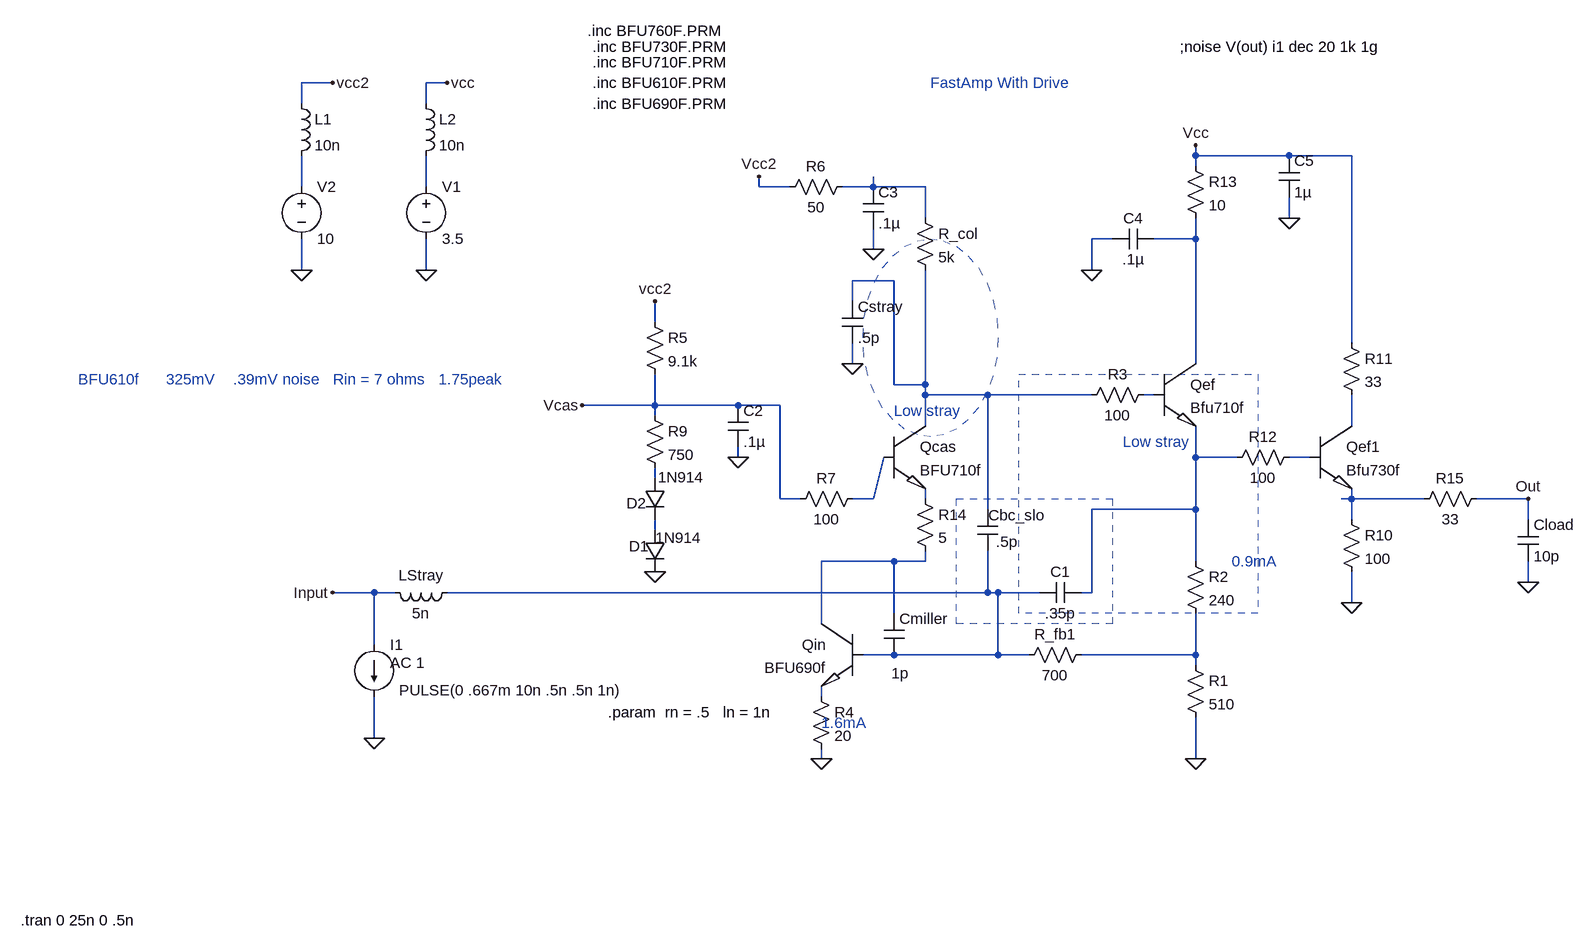
[diagram p0: schematic FastCE_Amp.asc]
FastCE_Amp.asc, the LTspice schematic file:
Version 4
SHEET 1 880 680
WIRE -1328 -1232 -1376 -1232
WIRE -1152 -1232 -1184 -1232
WIRE -1376 -1200 -1376 -1232
WIRE -1184 -1200 -1184 -1232
WIRE 0 -1120 0 -1136
WIRE 144 -1120 0 -1120
WIRE 240 -1120 144 -1120
WIRE 0 -1104 0 -1120
WIRE -1376 -1072 -1376 -1120
WIRE -1184 -1072 -1184 -1120
WIRE -672 -1072 -672 -1088
WIRE -624 -1072 -672 -1072
WIRE -496 -1072 -496 -1088
WIRE -496 -1072 -544 -1072
WIRE -416 -1072 -496 -1072
WIRE -416 -1024 -416 -1072
WIRE 144 -1024 144 -1056
WIRE -128 -992 -160 -992
WIRE 0 -992 0 -1024
WIRE 0 -992 -64 -992
WIRE -496 -976 -496 -1008
WIRE -1376 -944 -1376 -992
WIRE -1184 -944 -1184 -992
WIRE -160 -944 -160 -992
WIRE -464 -928 -528 -928
WIRE -528 -896 -528 -928
WIRE -832 -864 -832 -896
WIRE 240 -832 240 -1120
WIRE -528 -800 -528 -832
WIRE 0 -800 0 -992
WIRE -464 -768 -464 -928
WIRE -416 -768 -416 -944
WIRE -416 -768 -464 -768
WIRE -416 -752 -416 -768
WIRE -320 -752 -416 -752
WIRE -160 -752 -320 -752
WIRE -64 -752 -80 -752
WIRE -832 -736 -832 -784
WIRE -832 -736 -944 -736
WIRE -704 -736 -832 -736
WIRE -640 -736 -704 -736
WIRE -832 -720 -832 -736
WIRE -416 -704 -416 -752
WIRE 240 -704 240 -752
WIRE -704 -656 -704 -672
WIRE 0 -656 0 -704
WIRE 64 -656 0 -656
WIRE 176 -656 144 -656
WIRE -832 -624 -832 -640
WIRE -640 -592 -640 -736
WIRE -608 -592 -640 -592
WIRE -496 -592 -480 -656
WIRE -496 -592 -528 -592
WIRE -416 -592 -416 -608
WIRE 240 -592 240 -608
WIRE 240 -592 224 -592
WIRE 352 -592 240 -592
WIRE 512 -592 432 -592
WIRE -320 -576 -320 -752
WIRE 0 -576 0 -656
WIRE 0 -576 -160 -576
WIRE 240 -560 240 -592
WIRE 512 -560 512 -592
WIRE -832 -544 -832 -560
WIRE -464 -496 -576 -496
WIRE -416 -496 -416 -512
WIRE -416 -496 -464 -496
WIRE 0 -496 0 -576
WIRE 512 -464 512 -496
WIRE -1264 -448 -1328 -448
WIRE -1232 -448 -1264 -448
WIRE -320 -448 -320 -512
WIRE -320 -448 -1152 -448
WIRE -304 -448 -320 -448
WIRE -240 -448 -304 -448
WIRE -160 -448 -160 -576
WIRE -160 -448 -176 -448
WIRE 240 -432 240 -480
WIRE -464 -416 -464 -496
WIRE -576 -400 -576 -496
WIRE -1264 -368 -1264 -448
WIRE -464 -352 -512 -352
WIRE -304 -352 -304 -448
WIRE -304 -352 -464 -352
WIRE -256 -352 -304 -352
WIRE 0 -352 0 -416
WIRE 0 -352 -176 -352
WIRE 0 -336 0 -352
WIRE -576 -288 -576 -304
WIRE -1264 -224 -1264 -288
WIRE -576 -192 -576 -208
WIRE 0 -192 0 -256
FLAG 0 -1136 Vcc
FLAG -576 -192 0
FLAG 0 -192 0
FLAG -1328 -448 Input
FLAG -1184 -944 0
FLAG -1152 -1232 vcc
FLAG -1376 -944 0
FLAG -1328 -1232 vcc2
FLAG -672 -1088 Vcc2
FLAG -704 -656 0
FLAG -944 -736 Vcas
FLAG -832 -480 0
FLAG -832 -896 vcc2
FLAG -496 -976 0
FLAG -1264 -224 0
FLAG -528 -800 0
FLAG 240 -432 0
FLAG 512 -464 0
FLAG -160 -944 0
FLAG 144 -1024 0
FLAG 512 -592 Out
SYMBOL xnpn -512 -400 M0
SYMATTR InstName Qin
SYMATTR Value BFU690f
SYMBOL res -432 -1040 R0
SYMATTR InstName R_col
SYMATTR Value 5k
SYMBOL res -16 -352 R0
SYMATTR InstName R1
SYMATTR Value 510
SYMBOL xnpn -64 -800 R0
SYMATTR InstName Qef
SYMATTR Value Bfu710f
SYMBOL res -16 -512 R0
SYMATTR InstName R2
SYMATTR Value 240
SYMBOL res -160 -368 R90
WINDOW 0 0 56 VBottom 2
WINDOW 3 32 56 VTop 2
SYMATTR InstName R_fb1
SYMATTR Value 700
SYMBOL res -64 -768 R90
WINDOW 0 0 56 VBottom 2
WINDOW 3 32 56 VTop 2
SYMATTR InstName R3
SYMATTR Value 100
SYMBOL res -592 -304 R0
SYMATTR InstName R4
SYMATTR Value 20
SYMBOL cap -176 -464 R90
WINDOW 0 0 32 VBottom 2
WINDOW 3 32 32 VTop 2
SYMATTR InstName C1
SYMATTR Value .35p
SYMBOL current -1264 -368 R0
WINDOW 123 24 28 Left 2
WINDOW 39 0 0 Left 2
WINDOW 3 38 70 Left 2
SYMATTR Value2 AC 1
SYMATTR Value PULSE(0 .667m 10n .5n .5n 1n)
SYMATTR InstName I1
SYMBOL voltage -1184 -1088 R0
SYMATTR InstName V1
SYMATTR Value 3.5
SYMBOL voltage -1376 -1088 R0
WINDOW 123 0 0 Left 2
WINDOW 39 0 0 Left 2
SYMATTR InstName V2
SYMATTR Value 10
SYMBOL cap -336 -576 R0
WINDOW 0 17 9 Left 2
WINDOW 3 29 50 Left 2
SYMATTR InstName Cbc_slo
SYMATTR Value .5p
SYMBOL xnpn -480 -704 R0
SYMATTR InstName Qcas
SYMATTR Value BFU710f
SYMBOL res -512 -608 R90
WINDOW 0 0 56 VBottom 2
WINDOW 3 32 56 VTop 2
SYMATTR InstName R7
SYMATTR Value 100
SYMBOL cap -720 -736 R0
SYMATTR InstName C2
SYMATTR Value .1µ
SYMBOL diode -848 -544 R0
WINDOW 0 -24 25 Left 2
WINDOW 3 17 12 Left 2
SYMATTR InstName D1
SYMATTR Value 1N914
SYMBOL diode -848 -624 R0
WINDOW 0 -28 39 Left 2
WINDOW 3 21 -1 Left 2
SYMATTR InstName D2
SYMATTR Value 1N914
SYMBOL res -848 -880 R0
SYMATTR InstName R5
SYMATTR Value 9.1k
SYMBOL cap -512 -1072 R0
SYMATTR InstName C3
SYMATTR Value .1µ
SYMBOL res -528 -1088 R90
WINDOW 0 0 56 VBottom 2
WINDOW 3 32 56 VTop 2
SYMATTR InstName R6
SYMATTR Value 50
SYMBOL ind -1136 -464 R90
WINDOW 0 5 56 VBottom 2
WINDOW 3 32 56 VTop 2
SYMATTR InstName LStray
SYMATTR Value 5n
SYMBOL res -848 -736 R0
SYMATTR InstName R9
SYMATTR Value 750
SYMBOL cap -544 -896 R0
SYMATTR InstName Cstray
SYMATTR Value .5p
SYMBOL xnpn 176 -704 R0
SYMATTR InstName Qef1
SYMATTR Value Bfu730f
SYMBOL res 224 -576 R0
SYMATTR InstName R10
SYMATTR Value 100
SYMBOL res 224 -848 R0
SYMATTR InstName R11
SYMATTR Value 33
SYMBOL cap 496 -560 R0
SYMATTR InstName Cload
SYMATTR Value 10p
SYMBOL res 160 -672 R90
WINDOW 0 0 56 VBottom 2
WINDOW 3 32 56 VTop 2
SYMATTR InstName R12
SYMATTR Value 100
SYMBOL ind -1392 -1216 R0
SYMATTR InstName L1
SYMATTR Value 10n
SYMBOL ind -1200 -1216 R0
SYMATTR InstName L2
SYMATTR Value 10n
SYMBOL res -16 -1120 R0
SYMATTR InstName R13
SYMATTR Value 10
SYMBOL cap -64 -1008 R90
WINDOW 0 0 32 VBottom 2
WINDOW 3 32 32 VTop 2
SYMATTR InstName C4
SYMATTR Value .1µ
SYMBOL cap -480 -416 R0
WINDOW 3 12 92 Left 2
SYMATTR InstName Cmiller
SYMATTR Value 1p
SYMBOL cap 128 -1120 R0
SYMATTR InstName C5
SYMATTR Value 1µ
SYMBOL res -432 -608 R0
SYMATTR InstName R14
SYMATTR Value 5
SYMBOL res 448 -608 R90
WINDOW 0 0 56 VBottom 2
WINDOW 3 32 56 VTop 2
SYMATTR InstName R15
SYMATTR Value 33
TEXT -928 -1288 Left 2 !.inc BFU730F.PRM
TEXT -928 -1264 Left 2 !.inc BFU710F.PRM
TEXT -904 -264 Left 2 !.param  rn = .5   ln = 1n
TEXT -1808 56 Left 2 !.tran 0 25n 0 .5n
TEXT -928 -1232 Left 2 !.inc BFU610F.PRM
TEXT -928 -1200 Left 2 !.inc BFU690F.PRM
TEXT -24 -1288 Left 2 !;noise V(out) i1 dec 20 1k 1g
TEXT -1720 -776 Left 2 ;BFU610f      325mV    .39mV noise   Rin = 7 ohms   1.75peak
TEXT -576 -248 Left 2 ;1.6mA
TEXT 56 -496 Left 2 ;0.9mA
TEXT -464 -728 Left 2 ;Low stray
TEXT -112 -680 Left 2 ;Low stray
TEXT -408 -1232 Left 2 ;FastAmp With Drive
TEXT -936 -1312 Left 2 !.inc BFU760F.PRM
RECTANGLE Normal -128 -400 -368 -592 2
RECTANGLE Normal 96 -416 -272 -784 2
CIRCLE Normal -512 -688 -304 -992 2

The netlist it stands for:
* FastCE_Amp.asc
XQin N015 N016 N018 BFU690f  ; pins C B E
R_col N003 N005 5k
R1 N017 0 510
XQef N004 N006 N008 Bfu710f  ; pins C B E
R2 N008 N017 240
R_fb1 N017 N016 700
R3 N006 N005 100
R4 N018 0 20
C1 N008 N016 .35p
I1 Input 0 PULSE(0 .667m 10n .5n .5n 1n) AC 1
V1 N002 0 3.5
V2 N001 0 10
Cbc_slo N005 N016 .5p
XQcas N005 N011 N012 BFU710f  ; pins C B E
R7 N011 Vcas 100
C2 Vcas 0 .1µ
D1 N014 0 1N914
D2 N010 N014 1N914
R5 vcc2 Vcas 9.1k
C3 N003 0 .1µ
R6 N003 vcc2 50
LStray N016 Input 5n
R9 Vcas N010 750
Cstray N005 0 .5p
XQef1 N007 N009 N013 Bfu730f  ; pins C B E
R10 N013 0 100
R11 Vcc N007 33
Cload Out 0 10p
R12 N009 N008 100
L1 vcc2 N001 10n
L2 Vcc N002 10n
R13 Vcc N004 10
C4 N004 0 .1µ
Cmiller N015 N016 1p
C5 Vcc 0 1µ
R14 N012 N015 5
R15 Out N013 33
.model D D
.lib standard.dio
.inc BFU730F.PRM
.inc BFU710F.PRM
.param  rn = .5   ln = 1n
.tran 0 25n 0 .5n
.inc BFU610F.PRM
.inc BFU690F.PRM
;noise V(out) i1 dec 20 1k 1g
* BFU610f      325mV    .39mV noise   Rin = 7 ohms   1.75peak
* 1.6mA
* 0.9mA
* Low stray
* Low stray
* FastAmp With Drive
.inc BFU760F.PRM
.backanno
.end